# EasyEDA Pro project bmi270_modul.eprj

# Schematic SCH1
Create Date: 2023-12-02; Page Name: P1; Project Name: bmi270_modul; Schematic Name: SCH1; Update Date: 2023-12-03; Drawed: luq; Page Size: A4; Version: V1.0
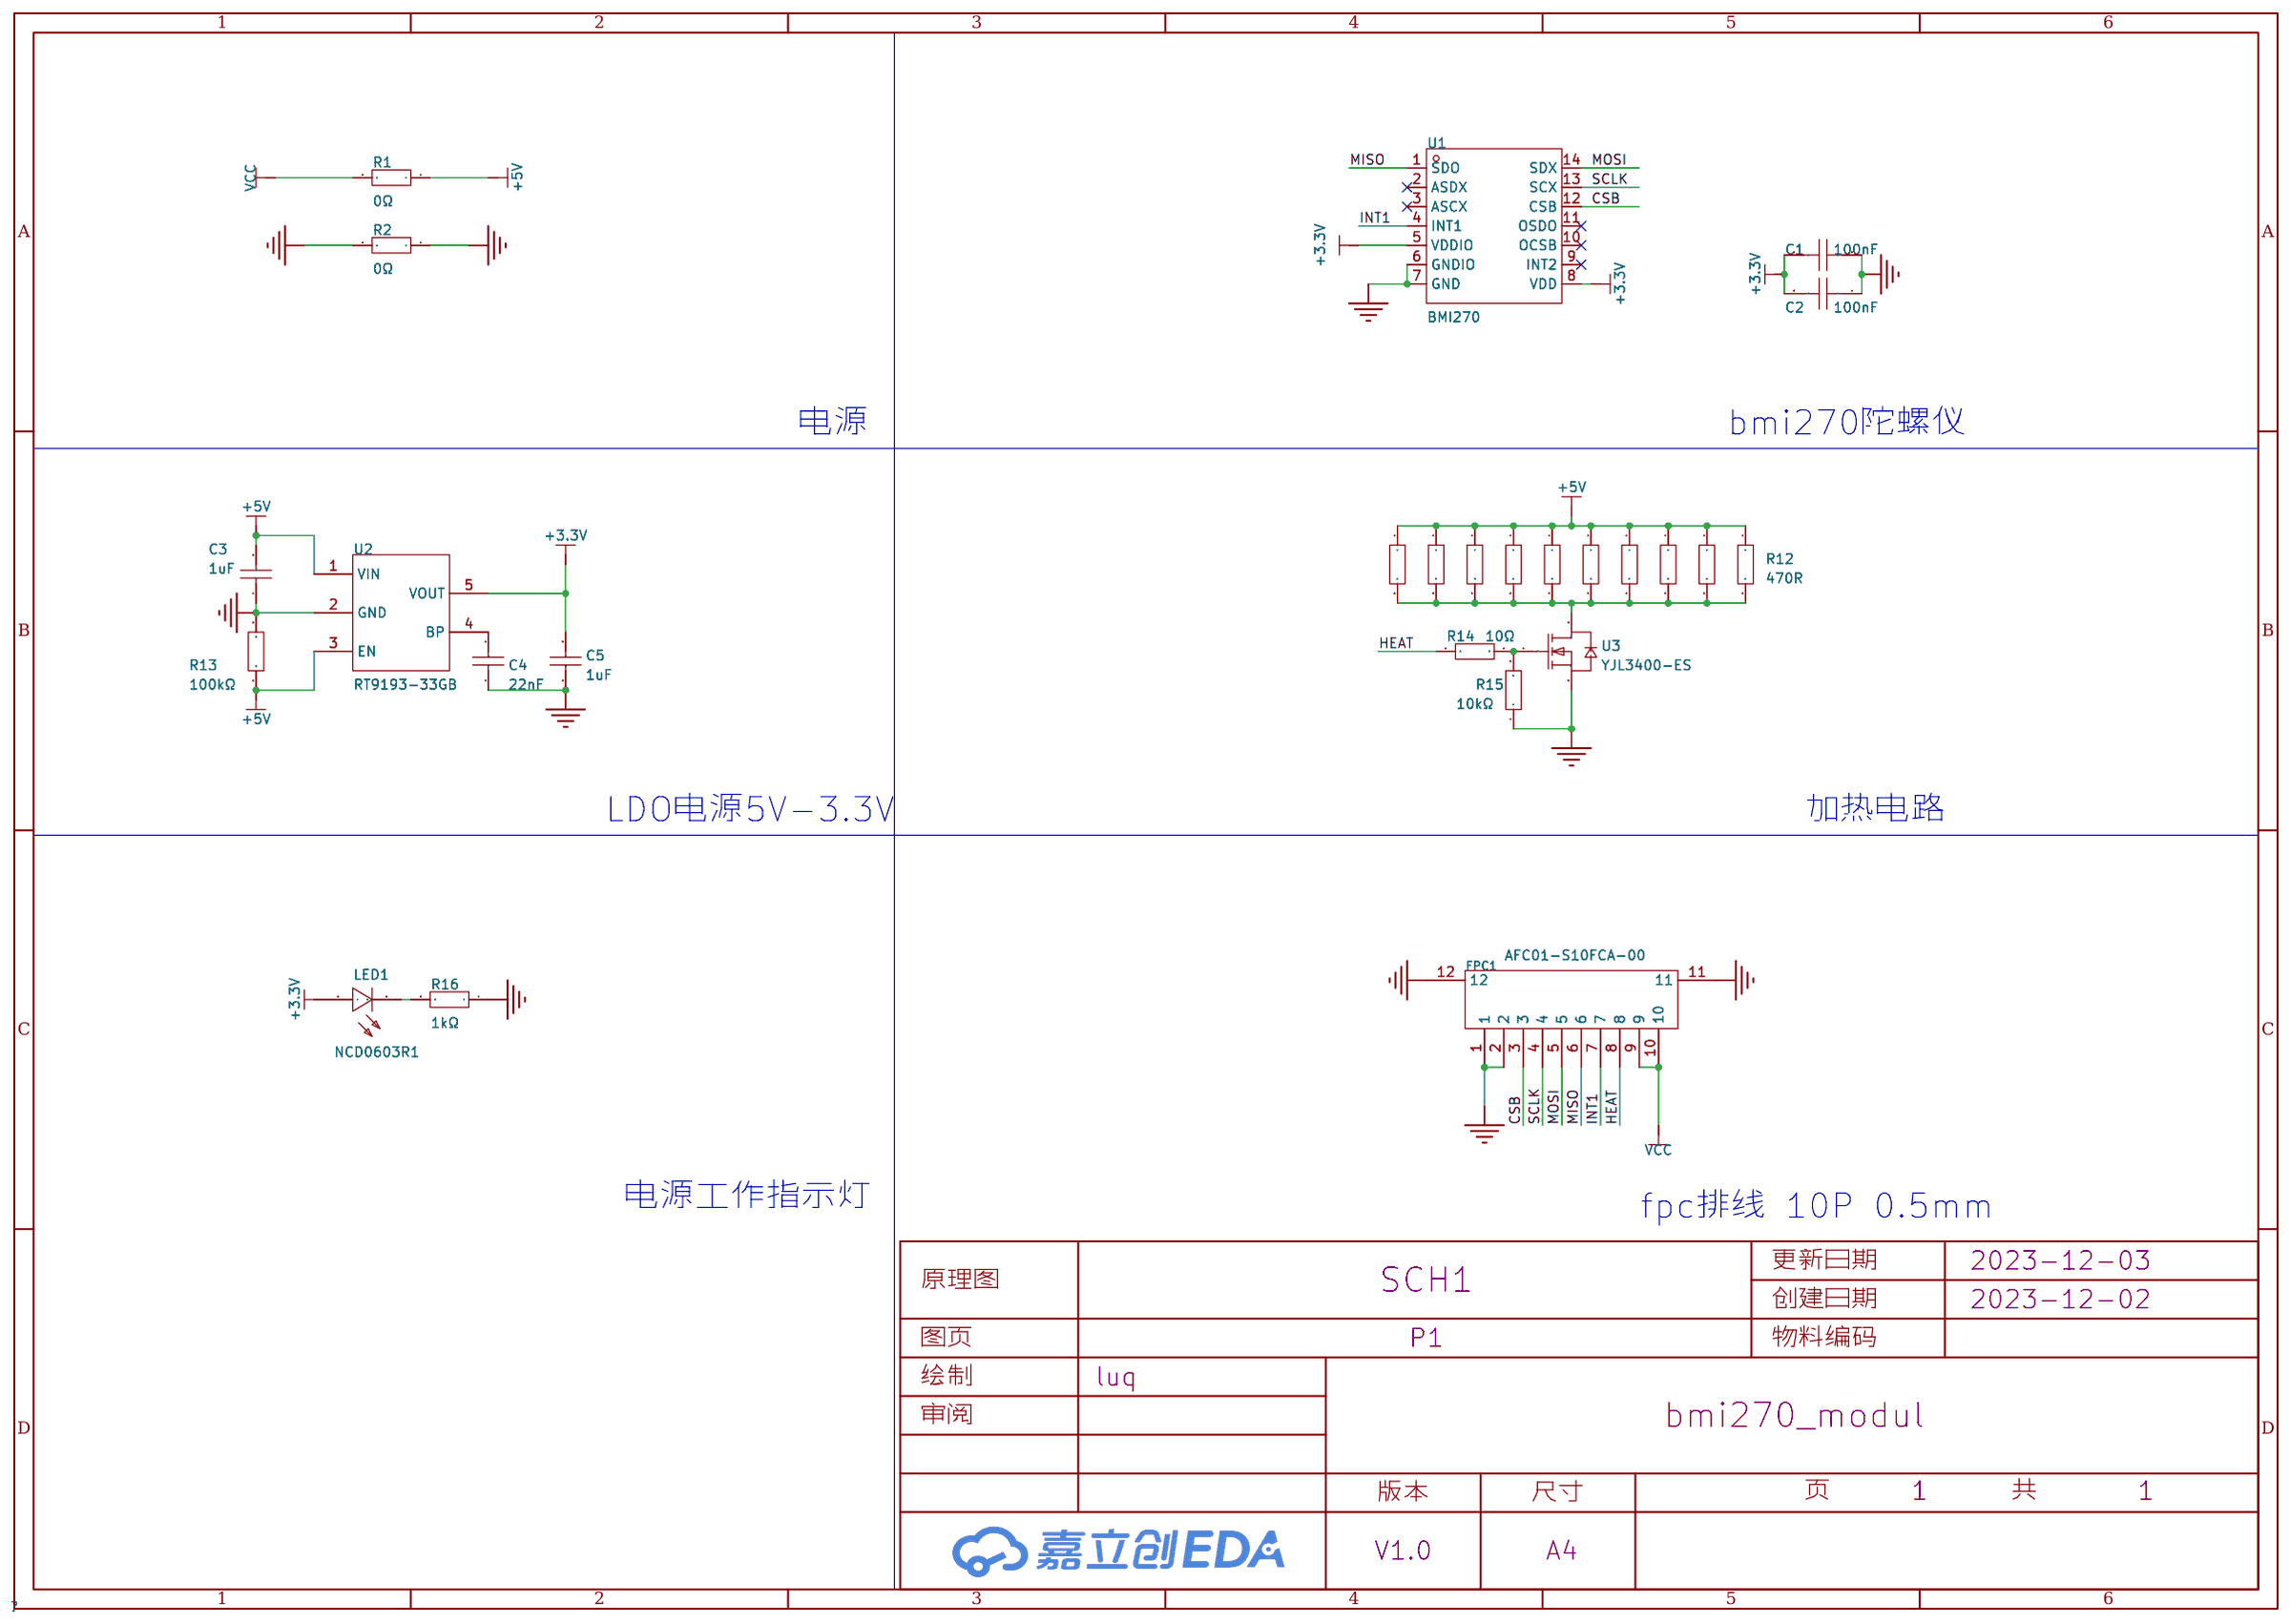
[diagram p0: schematic sheet]

## Parts
C1  100nF  [C0402]
C2  100nF  [C0402]
C3  1uF  [C0402]
C4  22nF  [C0402]
C5  1uF  [C0402]
FPC1  AFC01-S10FCA-00  [FPC-SMD_P0.5-10P_FGS-XJ-H2.0]
LED1  NCD0603R1  [LED0603-RD_RED]
R1  0Ω  [R0402]
R2  0Ω  [R0402]
R3  470R  [R0402]
R4  470R  [R0402]
R5  470R  [R0402]
R6  470R  [R0402]
R7  470R  [R0402]
R8  470R  [R0402]
R9  470R  [R0402]
R10  470R  [R0402]
R11  470R  [R0402]
R12  470R  [R0402]
R13  100kΩ  [R0402]
R14  10Ω  [R0402]
R15  10kΩ  [R0402]
R16  1kΩ  [R0402]
U1  BMI270  [LGA-14_L3.0-W2.5-P0.50-BR]
U2  RT9193-33GB  [SOT-23-5_L3.0-W1.7-P0.95-LS2.8-BL]
U3  YJL3400-ES  [SOT-23-3_L2.9-W1.3-P1.90-LS2.4-BR]

## Library data of the parts
C1 C2 = GRM155R71H104KE14D: 容值:100nF;精度:±10%;额定电压:50V;材质(温度系数):X7R;; LCSC Part Name: 100nF ±10% 50V; Supplier Part: C77020; Manufacturer: muRata(村田); Supplier Footprint: 0402; JLCPCB Part Class: Extended Part; Datasheet: https://atta.szlcsc.com/upload/public/pdf/source/20180326/C77020_39BD49C951FF1AF0DB1F1FAC5AC1E401.pdf; Supplier: LCSC; Tolerance: ±10%; Voltage Rated: 50V; Temperature Coefficient: X7R
C3 C5 = CL05A105KP5NNNC: 容值:1uF;精度:±10%;额定电压:10V;材质(温度系数):X5R;; LCSC Part Name: 1uF ±10% 10V; Supplier Part: C14445; Manufacturer: SAMSUNG(三星); Supplier Footprint: 0402; JLCPCB Part Class: 扩展库; Datasheet: https://atta.szlcsc.com/upload/public/pdf/source/20160218/1457707763339.pdf; Supplier: LCSC; Tolerance: ±10%; Voltage Rated: 10V; Temperature Coefficient: X5R
C4 = 0402B223K500NT: 容值:22nF;精度:±10%;额定电压:50V;材质(温度系数):X7R;; LCSC Part Name: 22nF ±10% 50V; Supplier Part: C1532; Manufacturer: FH(风华); Supplier Footprint: 0402; JLCPCB Part Class: 基础库; Datasheet: https://atta.szlcsc.com/upload/public/pdf/source/20200305/C486355_26A10D38EF8C2A5C37091D0039909270.pdf; Supplier: LCSC; Tolerance: ±10%; Voltage Rated: 50V; Temperature Coefficient: X7R
FPC1 = AFC01-S10FCA-00: 间距:0.5mm;触点数量:10P;锁定特性:翻盖式;安装类型:卧贴;触点类型:下接;; LCSC Part Name: 0.5mm P数:10P 翻盖式 下接; Supplier Part: C262659; Manufacturer: JS(钜硕电子); Supplier Footprint: SMD,P=0.5mm; JLCPCB Part Class: 扩展库; Datasheet: https://atta.szlcsc.com/upload/public/pdf/source/20190816/C413942_2A72D1AC756EAE17EEDF756A339D4500.pdf; Supplier: LCSC; Pitch: 0.5mm; Number of Contacts: 10P; Locking Feature: 翻盖式; Mounting Type: 卧贴; Contact Type: 下接; Height Above Board: 2mm; FFC, FCB Thickness: 0.3mm
LED1 = NCD0603R1_C84263: 发光颜色:红色;功率:65mW;透镜颜色:无色透明;主波长:615nm~630nm;发光强度:80mcd~220mcd;发光角度:130°;工作温度:-30℃~+85℃;; LCSC Part Name: 红灯 0603红灯   正贴; Supplier Part: C84263; Manufacturer: 国星光电; Supplier Footprint: 0603; JLCPCB Part Class: Extended Part; Datasheet: https://atta.szlcsc.com/upload/public/pdf/source/20200820/C84263_DABC6A75E58F576973B407FDBA283D60.pdf; Supplier: LCSC; Emitted Color: 红色; Forward Voltage (VF): 1.6V~2.6V; Forward Current: 20mA; Power Dissipation: 65mW; Lens Color: 无色透明; Dominant Wavelength: 615nm~630nm; Luminous Intensity: 80mcd~220mcd; Viewing Angle: 130°; Operating Temperature: -30℃~+85℃
R1-R16 = RC0402FR-07100KL: 电阻类型:厚膜电阻;阻值:100kΩ;精度:±1%;功率:62.5mW;; LCSC Part Name: 100kΩ ±1% 62.5mW; Supplier Part: C60491; Manufacturer: YAGEO(国巨); Supplier Footprint: 0402; JLCPCB Part Class: Extended Part; Datasheet: https://atta.szlcsc.com/upload/public/pdf/source/20170518/1495086055123.pdf; Supplier: LCSC; Type: 厚膜电阻; Tolerance: ±1%; Power(Watts): 62.5mW; Temperature Coefficient: ±100ppm/℃; Overload Voltage (Max): 50V; Operating Temperature Range: -55℃~+155℃
U1 = BMI270: IMU-惯性测量单元; Supplier Part: C2836813; Manufacturer: Bosch(博世); Supplier Footprint: LGA-14(2.5x3); JLCPCB Part Class: 扩展库; Datasheet: https://atta.szlcsc.com/upload/public/pdf/source/20210625/C2836813_35E1F3F92097F45A3828DF13DDBA01A5.pdf; Supplier: LCSC
U2 = RT9193-33GB: 输出类型:固定;输出极性:正;输出通道数:1;最大输入电压:5.5V;输出电压:3.3V;压差:300mV@(300mA);输出电流:300mA;电源纹波抑制比(PSRR):70dB;; LCSC Part Name: 正 Vin=5.5V Vout=3.3V 300mA 70dB; Supplier Part: C15651; Manufacturer: RICHTEK(立锜); Supplier Footprint: SOT-23-5; JLCPCB Part Class: 扩展库; Datasheet: https://atta.szlcsc.com/upload/public/pdf/source/20130730/1457706628575.pdf; Supplier: LCSC; Output Type: 固定; Output Polarity: 正; Number of Outputs: 1; Maximum Input Voltage: 5.5V; Output Voltage: 3.3V; Dropout Voltage: 300mV@(300mA); Output Current: 300mA; Power Supply Rejection Ratio (PSRR): 70dB
U3 = YJL3400-ES: 类型:N沟道;漏源电压(Vdss):30V;连续漏极电流(Id):6A;功率(Pd):1.4W;导通电阻(RDS(on)@Vgs,Id):19mΩ@10V,6.0A;; LCSC Part Name: N沟道 耐压:30V 电流:6A; Supplier Part: C5224193; Manufacturer: ElecSuper(静芯微）; Supplier Footprint: SOT-23(TO-236); JLCPCB Part Class: 扩展库; Datasheet: https://atta.szlcsc.com/upload/public/pdf/source/20221027/7D40D8511ACDFF6C838F09B83D496410.pdf; Supplier: LCSC; Type: N沟道; Drain Source Voltage (Vdss): 30V; Continuous Drain Current (Id): 6A; Power Dissipation (Pd): 1.4W; Drain Source On Resistance (RDS(on)@Vgs,Id): 19mΩ@10V,6.0A; Gate Threshold Voltage (Vgs(th)@Id): 1V@250uA

## Nets
+3.3V: C1.2 C2.2 C5.2 LED1.2(A) U1.5(VDDIO) U1.8(VDD) U2.5(VOUT)
+5V: C3.2 R1.1 R3.1 R4.1 R5.1 R6.1 R7.1 R8.1 R9.1 R10.1 R11.1 R12.1 R13.1 U2.1(VIN) U2.3(EN)
GND: C1.1 C2.1 C3.1 C4.1 C5.1 FPC1.11 FPC1.12 R2.1 R13.2 R15.1 R16.1 U1.6(GNDIO) U1.7(GND) U2.2(GND) U3.2(S)
PGND: FPC1.1 FPC1.2 R2.2
VCC: FPC1.9 FPC1.10 R1.2
CSB: FPC1.3 U1.12(CSB)
HEAT: FPC1.8 R14.2
INT1: FPC1.7 U1.4(INT1)
MISO: FPC1.6 U1.1(SDO)
MOSI: FPC1.5 U1.14(SDX)
SCLK: FPC1.4 U1.13(SCX)
$C4_2: C4.2 U2.4(BP)
$LED1_1: LED1.1(K) R16.2
$R3_2: R3.2 R4.2 R5.2 R6.2 R7.2 R8.2 R9.2 R10.2 R11.2 R12.2 U3.3(D)
$R14_1: R14.1 R15.2 U3.1(G)

Not connected (* = marked no-connect by the designer): U1 2(ASDX)* 3(ASCX)* 9(INT2)* 10(OCSB)* 11(OSDO)*

## Notes on the sheet
- 电源
- bmi270陀螺仪
- LDO电源5V-3.3V
- 加热电路
- 电源工作指示灯
- fpc排线 10P 0.5mm

# Board PCB1
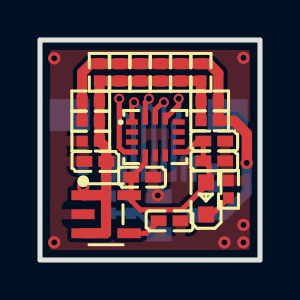
[diagram p1: board, top side]
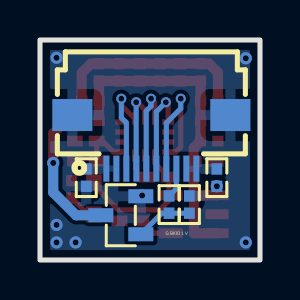
[diagram p2: board, bottom side, seen from below]

Outline 11 x 11 mm; copper layers: Top Layer, Bottom Layer. Coordinates in mm from the lower left corner of the outline.
Outline path: rectangle 0,11 11,0
Stack: Top Layer 0.035mm / Dielectric1 1.51mm FR4 er 4.5 / Bottom Layer 0.035mm

## Design rules (mm)
template: 自定义配置
spacing copperThickness1oz (default): track to track 0.102, other pairs 0.152 to 0.3
spacing copperThickness2oz: track to track 0.203, other pairs 0.152 to 0.3
spacing 6mil: track to track 0.102, other pairs 0.152 to 0.152
track width copperThickness1oz (default): min 0.127, default 0.254, max 2.54
track width copperThickness2oz: min 0.203, default 0.254, max 2.54
track width 10mil: min 0.254, default 0.254, max 2.54
track width 20mil: min 0.508, default 0.508, max 2.54
differential pair differentialPair (default): width min 0.127, default 0.254, max 2.54; gap min 0.152, default 0.152
differential pair err=5mil: width min 0.127, default 0.254, max 2.54; gap min 0.152, default 0.254
via viaSize (default): diameter min 0.5, default 0.61, max 10; hole min 0.3, default 0.305, max 6.299
via 12-24: diameter min 0.5, default 0.61, max 10; hole min 0.3, default 0.305, max 6.299
net GND uses flood
net VCC uses flood
net PGND uses flood

## Placement (name value [footprint] x y rotation side)
C1  100nF  [C0402]  8.71 5.95 180 top
C2  100nF  [C0402]  8.71 4.95 180 top
C3  1uF  [C0402]  2.77 4.93 0 top
C4  22nF  [C0402]  6.48 1.96 180 top
C5  1uF  [C0402]  5.11 4.14 180 top
FPC1  AFC01-S10FCA-00  [FPC-SMD_P0.5-10P_FGS-XJ-H2.0]  5.43 5.91 180 bottom
LED1  NCD0603R1  [LED0603-RD_RED]  8.31 3.08 90 top
R1  0Ω  [R0402]  2.16 4.12 90 bottom
R2  0Ω  [R0402]  8.69 4.12 90 bottom
R3  470R  [R0402]  8.05 9.38 90 top
R4  470R  [R0402]  2.54 7.95 180 top
R5  470R  [R0402]  2.54 6.94 180 top
R6  470R  [R0402]  2.96 9.38 90 top
R7  470R  [R0402]  3.99 9.38 90 top
R8  470R  [R0402]  8.48 7.95 0 top
R9  470R  [R0402]  8.48 6.96 0 top
R10  470R  [R0402]  5 9.38 90 top
R11  470R  [R0402]  6.02 9.38 90 top
R12  470R  [R0402]  7.04 9.38 90 top
R13  100kΩ  [R0402]  2.54 5.95 180 top
R14  10Ω  [R0402]  4.55 2.77 90 bottom
R15  10kΩ  [R0402]  3.53 2.77 270 bottom
R16  1kΩ  [R0402]  9.42 3.53 270 top
U1  BMI270  [LGA-14_L3.0-W2.5-P0.50-BR]  5.77 6.15 180 top
U2  RT9193-33GB  [SOT-23-5_L3.0-W1.7-P0.95-LS2.8-BL]  3.3 2.29 270 top
U3  YJL3400-ES  [SOT-23-3_L2.9-W1.3-P1.90-LS2.4-BR]  6.96 2.24 180 bottom

## Footprints (pads in the part's own frame, mm; a bottom-side part is the same pattern mirrored in y, then rotated)
C0402
  rect 0.79x0.54 smd: 1(-0.545,0) 2(0.545,0)
FPC-SMD_P0.5-10P_FGS-XJ-H2.0
  rect 0.3x1.3 smd: 1(-2.25,-1.339) 2(-1.75,-1.339) 3(-1.25,-1.34) 4(-0.75,-1.339) 5(-0.25,-1.34) 6(0.25,-1.339) 7(0.75,-1.339) 8(1.25,-1.339) 9(1.75,-1.339) 10(2.25,-1.34)
  rect 2x1.6 smd: 11(3.95,1.34) 12(-3.95,1.34)
LED0603-RD_RED
  rect 0.8x0.8 smd: 1(-0.799,-0.004) 2(0.799,0.004)
LGA-14_L3.0-W2.5-P0.50-BR
  rect 0.6x0.27 smd: 1(1.17,-0.75) 2(1.17,-0.25) 3(1.17,0.25) 4(1.17,0.75) 8(-1.17,0.75) 9(-1.17,0.25) 10(-1.17,-0.25) 11(-1.17,-0.75)
  rect 0.27x0.6 smd: 5(0.5,0.92) 6(0,0.92) 7(-0.5,0.92) 12(-0.5,-0.92) 13(0,-0.92) 14(0.5,-0.92)
R0402
  rect 0.566x0.54 smd: 1(-0.433,0) 2(0.433,0)
SOT-23-3_L2.9-W1.3-P1.90-LS2.4-BR
  rect 1.25x0.7 smd: 1(1,-0.95) 2(1,0.95) 3(-1,0)
SOT-23-5_L3.0-W1.7-P0.95-LS2.8-BL
  rect 0.49x1.157 smd: 1(-0.95,-1.153) 2(0,-1.153) 3(0.95,-1.153)
  rect 0.49x1.175 smd: 4(0.95,1.153) 5(-0.95,1.153)

## Nets
As in the schematic.

Pads without a net: U1 2 3 9 10 11

## Via types
v1: diameter 0.5, hole 0.3, Top Layer to Bottom Layer, 5 vias
v2: diameter 0.61, hole 0.305, Top Layer to Bottom Layer, 9 vias

## Routing (per net, layer and track width the routed paths; a pad name or vN(x,y) marks a point on that pad's centre or on a via; arc(x,y) is an arc through that point)
+3.3V: length 11
  Top Layer w0.254: 4.56,3.34 U2.5 ; 4.56,3.34 4.56,2.96 5.01,2.51 7.09,2.51 8.45,3.87 8.45,4.67 C2.2 C1.2 7.87,5.95 7.33,5.4 U1.8 ; 4.56,3.34 C5.2 5.27,4.85 U1.5
+5V: length 18.7
  Top Layer w0.508: 2.16,3.25 3.31,3.25 C3.2 3.31,5.6 R13.1 2.97,8.94 R6.1 R7.1 R10.1 R11.1 R12.1 R3.1 ; 2.16,3.25 U2.1 3.3,3.24 3.3,1.34 U2.3 ; 2.16,3.25 v2(2.16,3.68) ; 8.05,8.95 R8.1 R9.1
GND:
  vias: v2(0.71,10.09) v2(0.71,0.88) v2(5.89,3.23) v2(9.22,0.88) v2(10.17,10.11) v2(10.17,1.75) v2(10.17,0.88)
$C4_2: length 1.7
  Top Layer w0.254: C4.2 5.31,1.34 U2.4
$LED1_1: length 1.5
  Top Layer w0.254: R16.2 8.6,2.28 LED1.1
$R3_2: length 19.5
  Top Layer w0.508: v2(10.34,4.85) 10.34,6.33 9.7,6.96 R9.2 R8.2 8.92,9.35 8.45,9.82 R3.2 R12.2 R11.2 R10.2 R7.2 R6.2 2.55,9.82 2.1,9.37 R4.2 R5.2
  Bottom Layer w0.508: U3.3 9.19,2.24 10.34,3.38 v2(10.34,4.85)
$R14_1: length 2.9
  Bottom Layer w0.254: R15.2 R14.1 4.91,2.34 U3.1
CSB: length 4.9
  Top Layer w0.254: v1(6.93,8.07) 6.93,7.74 U1.12
  Bottom Layer w0.254: v1(6.93,8.07) 6.93,7.11 6.68,6.86 6.68,4.57
HEAT: length 1.5
  Bottom Layer w0.254: R14.2 4.18,3.57 FPC1.8
INT1: length 7
  Top Layer w0.254: U1.4 4.2,5.4 3.96,5.64 v1(3.96,8.07)
  Bottom Layer w0.254: FPC1.7 4.68,6.85 3.96,7.57 v1(3.96,8.07)
MISO: length 4.6
  Top Layer w0.254: U1.1 4.6,7.78 v1(4.71,7.89)
  Bottom Layer w0.254: FPC1.6 5.18,7.41 v1(4.71,7.89)
MOSI: length 4.7
  Top Layer w0.254: v1(5.45,8.07) 5.27,7.88 U1.14
  Bottom Layer w0.254: v1(5.45,8.07) 5.45,7.69 5.69,7.45 5.69,4.58 FPC1.5
SCLK: length 4.4
  Top Layer w0.254: U1.13 5.77,7.52 6.13,7.89 v1(6.19,7.89)
  Bottom Layer w0.254: v1(6.19,7.89) 6.19,4.58 FPC1.4

## Copper pours and planes (outline as drawn; the poured copper is in the pictures)
GND on Top Layer: -3.86,13.84 15.09,13.84 15.09,-2.56 -3.86,-2.56
GND on Bottom Layer: -1.83,13.23 13.69,13.23 13.69,-2.56 -1.83,-2.56
PGND on Bottom Layer: 7.04,5.21 7.83,5.21 8.21,4.83 8.92,4.83 8.94,4.8 8.94,4.29 8.97,4.27 8.18,4.27 7.83,3.92 7.04,3.92
VCC on Bottom Layer: 3.83,3.93 2.99,3.93 2.63,4.28 1.9,4.28 1.9,4.84 2.66,4.84 3.03,5.21 3.83,5.21

## Text on the board
Bottom Silkscreen Layer: G BKIO 1 V
Document Layer: L11-W11-R0mm
